# EAGLE design dual_sensor_module (EAGLE 9.4.2)
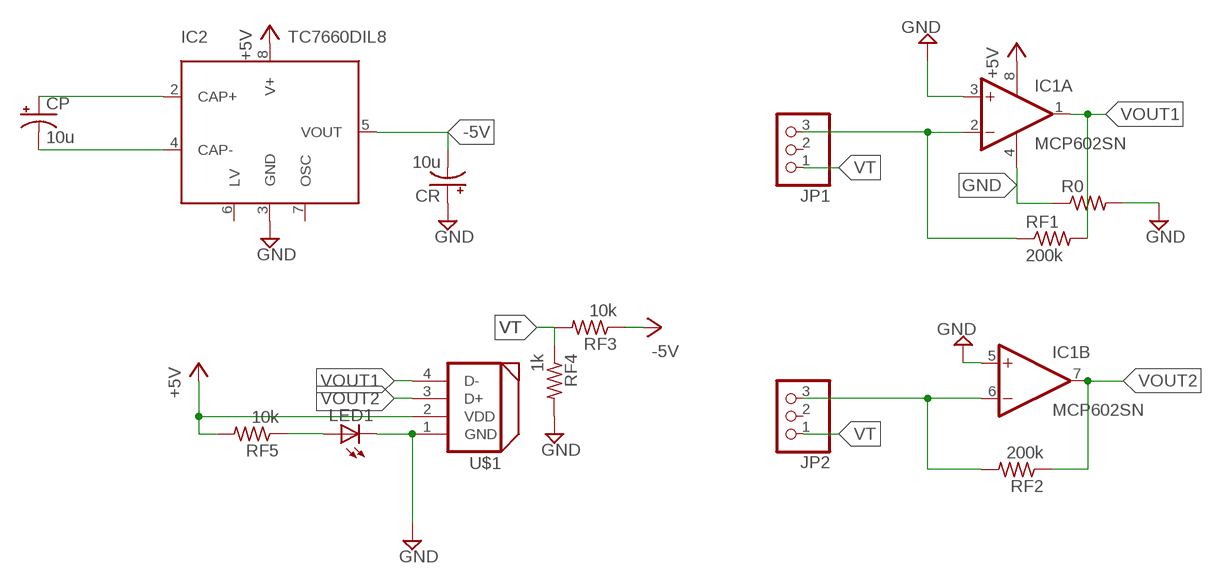
[diagram p0: schematic, sheet 1]

## Parts
CP  10u  CPOL-USE2.5-5  [E2,5-5]
CR  10u  CPOL-USE2.5-5  [E2,5-5]
IC1  MCP602SN  [SO08]
IC2  TC7660DIL8  [DIL8]
JP1  PINHD-1X3  [1X03]
JP2  PINHD-1X3  [1X03]
LED1  LEDCHIPLED_0805  [CHIPLED_0805]
R0  R-US_R1206  [R1206]
RF1  200k  R-US_R0805  [R0805]
RF2  200k  R-US_R0805  [R0805]
RF3  10k  R-US_R0805  [R0805]
RF4  1k  R-US_R0805  [R0805]
RF5  10k  R-US_R0805  [R0805]
U$1  DYNAMIXEL_RS485  [DYNAMIXEL_SPOX_04]

## Nets
+5V: IC1.8(P:V+) IC2.8(V+) RF5.2 U$1.2(VDD)
-5V: CR.- IC2.5(VOUT) RF3.1
GND: CR.+ IC1.3(A:+IN) IC1.4(P:V-) IC1.5(B:+IN) IC2.3(GND) LED1.C R0.1 R0.2 RF4.2 U$1.1(GND)
N$1: CP.+ IC2.2(CAP+)
N$2: CP.- IC2.4(CAP-)
N$3: LED1.A RF5.1
N$52: IC1.2(A:-IN) JP1.3 RF1.1
N$82: IC1.6(B:-IN) JP2.3 RF2.2
VOUT1: IC1.1(A:OUT) RF1.2 U$1.4(D-)
VOUT2: IC1.7(B:OUT) RF2.1 U$1.3(D+)
VT: JP1.1 JP2.1 RF3.2 RF4.1
Unconnected: IC2.6(LV) IC2.7(OSC) JP1.2 JP2.2

## Library data of the parts
CP CR = rcl:CPOL-US: POLARIZED CAPACITOR, American symbol; SPICEPREFIX: C
IC1 = dedo:MCP602: Single Op Amp 2.7V to 6.0V Single Supply CMOS Source: http://ww1.microchip.com/downloads/en/DeviceDoc/21314g.pdf
IC2 = microchip_tc7660:TC7660: TC7660 Charge Pump DC-to-DC Voltage Converter
JP1 JP2 = adafruit:PINHD-1X3: PIN HEADER
LED1 = adafruit:LED: LED OSRAM: - CHIPLED LG R971, LG N971, LY N971, LG Q971, LY Q971, LO R971, LY R971 LH N974, LH R974 LS Q976, LO Q976, LY Q976 LO Q996 - Hyper CHIPLED LW Q18S LB Q993, LB Q99A, LB R99A - SideLED LS A670, LO A670, LY A670, LG A670, LP A670 LB A673, LV A673, LT A673, LW A673 LH A674 LY A675 LS A676, LA A676, LO A676, LY A676, LW A676 LS A679, LY A679, LG A679 - Hyper Micro SIDELED® LS Y876, LA Y876, LO Y876, LY Y876 LT Y87S - SmartLED LW L88C, LW L88S LB L89C, LB L89S, LG L890 LS L89K, LO L89K, LY L89K LS L896, LA L896, LO L896, LY L896 - TOPLED LS T670, LO T670, LY T670, LG T670, LP T670 LSG T670, LSP T670, LSY T670, LOP T670, LYG T670 LG T671, LOG T671, LSG T671 LB T673, LV T673, LT T673, LW T673 LH T674 LS T676, LA T676, LO T676, LY T676, LB T676, LH T676, LSB T676, LW T676 LB T67C, LV T67C, LT T67C, LS T67K, LO T67K, LY T67K, LW E67C LS E67B, LA E67B, LO E67B, LY E67B, LB E67C, LV E67C, LT E67C LW T67C LS T679, LY T679, LG T679 LS T770, LO T770, LY T770, LG T770, LP T770 LB T773, LV T773, LT T773, LW T773 LH T774 LS E675, LA E675, LY E675, LS T675 LS T776, LA T776, LO T776, LY T776, LB T776 LHGB T686 LT T68C, LB T68C - Hyper Mini TOPLED® LB M676 - Mini TOPLED Santana® LG M470 LS M47K, LO M47K, LY M47K Source: http://www.osram.convergy.de/
R0 = rcl:R-US_: RESISTOR, American symbol; SPICEPREFIX: R
RF1-RF5 = resistor:R-US_: RESISTOR, American symbol
U$1 = robot-hand:DYNAMIXEL_RS485: Dynamixel RS-485 Connector Molex LLC SPOX 4 Male connector Digikey code: WM18888-ND

## Net classes
0 default: clearance 0.205 mm

## Board
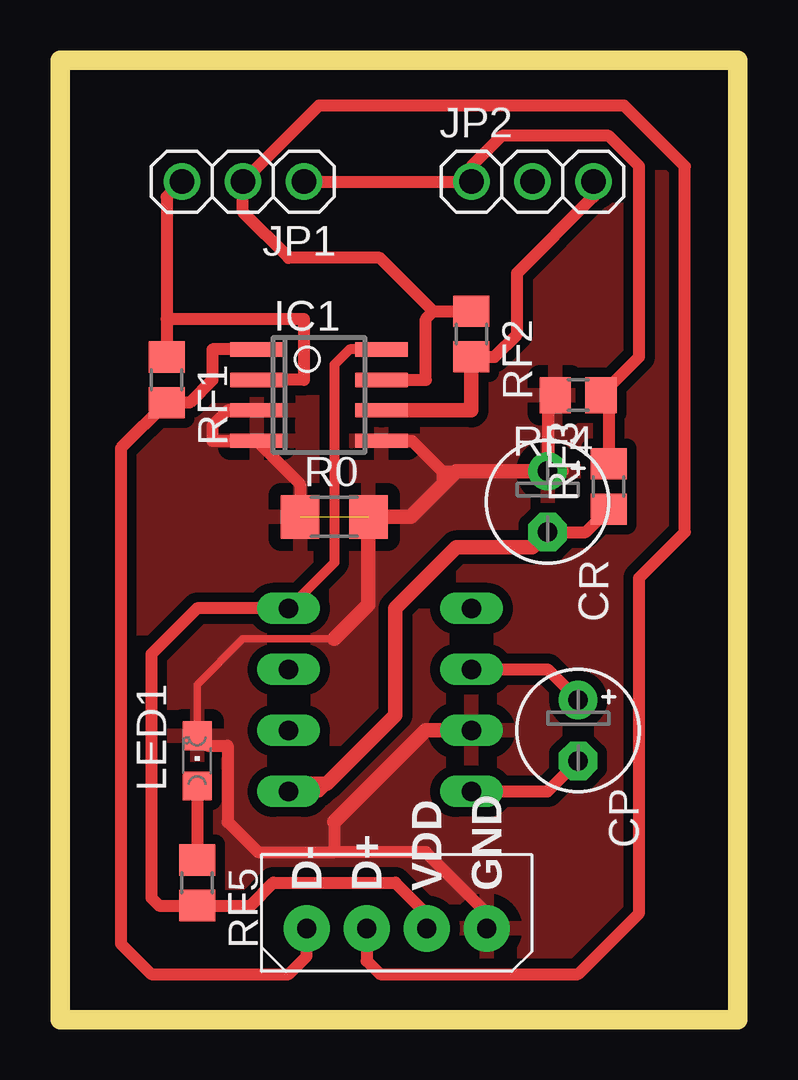
[diagram p1: board, top side]
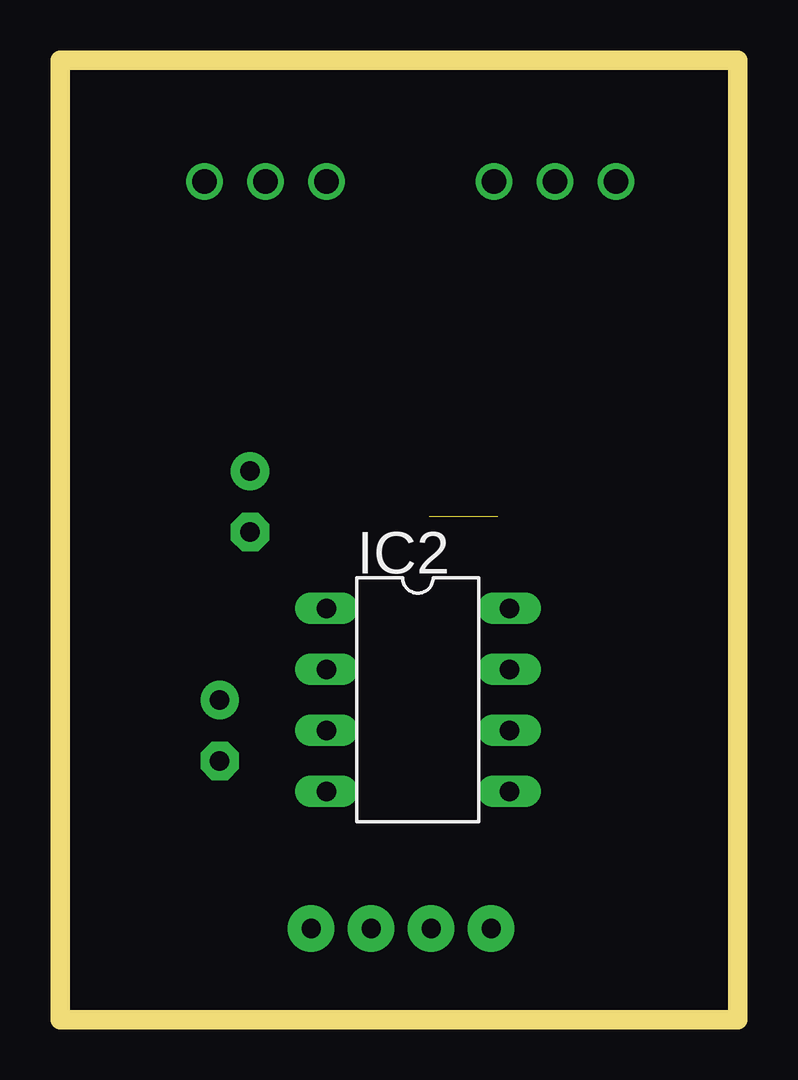
[diagram p2: board, bottom side, seen from below]

Size 28.25 x 39.99 mm. Coordinates in mm from the lower left corner, seen from the top.
Outline: 0,0 28.25,0 28.25,39.99 0,39.99 0,0
Copper layers (1*16): Top 0.035mm / dielectric 1.5mm / Bottom 0.035mm
Design rules "Fablab U. de Chile": minimum track width 0.3mm, minimum drill 0.6mm, track to track 0.3mm, track to pad 0.3mm, pad to pad 0.3mm, via to via 0.3mm, smd to smd 0.3mm, copper to edge 1mm, drill to drill 0.3mm, minimum pad ring 10mil, minimum via ring 10mil, stop-mask expansion 10mil, vias tented up to drill 0mil, thermal gap 20mil

### Footprints (pad centres in the part's own frame; a part is rotated, then mirrored left to right if it is on the bottom)
E2,5-5 = drill 0.813 pad 1.6: + -1.27,0 | drill 0.813 pad 1.6 octagon: - 1.27,0
SO08 = smd 0.6 x 2.2: 1 -1.905,-2.6; 2 -0.635,-2.6; 3 0.635,-2.6; 4 1.905,-2.6; 5 1.905,2.6; 6 0.635,2.6; 7 -0.635,2.6; 8 -1.905,2.6
DIL8 = drill 0.813 long: 1 -3.81,-3.81; 2 -1.27,-3.81; 3 1.27,-3.81; 4 3.81,-3.81; 5 3.81,3.81; 6 1.27,3.81; 7 -1.27,3.81; 8 -3.81,3.81
1X03 = drill 1.016: 1 -2.54,0; 2 0,0; 3 2.54,0
CHIPLED_0805 = smd 1.2 x 1.2: A 0,-1.05; C 0,1.05
R1206 = smd 1.6 x 1.803: 1 -1.422,0; 2 1.422,0
R0805 = smd 1.3 x 1.5: 1 -0.95,0; 2 0.95,0
DYNAMIXEL_SPOX_04 = drill 0.8 pad 1.93: 1 0,0; 2 2.5,0; 3 5,0; 4 7.5,0

### Placement (x,y rotation side)
CP  21.59,12.06 270 top
CR  20.32,21.59 270 top
IC1  10.79,26.04 270 top
IC2  13.33,13.33 270 bottom
JP1  7.62,34.92 180 top
JP2  19.69,34.92 0 top
LED1  5.71,10.79 0 top
R0  11.43,20.96 0 top
RF1  4.45,26.67 270 top
RF2  17.15,28.58 270 top
RF3  22.86,22.23 90 top
RF4  21.59,26.04 180 top
RF5  5.71,5.71 270 top
U$1  17.78,3.81 180 top

### Tracks (layer width: path | path; a pad name or v marks a point on that pad's centre or on a via)
+5V
  Top 0.408: IC1.8 12.06,27.94 11.43,27.31 11.43,19.05 IC2.8
  Top 0.508: IC2.8 5.71,17.15 3.81,15.24 3.81,5.08 4.12,4.76 RF5.2 7.94,4.76 8.89,5.71 13.97,5.71 15.28,4.41 U$1.2
-5V
  Top 0.508: IC2.5 10.16,9.53 10.79,9.53 11.11,9.84 | 22.54,20.96 RF3.1 21.91,20.32 CR.-
  Top 0.61: CR.- 19.69,19.69 16.51,19.69 13.97,17.15 13.97,12.7 11.11,9.84 10.48,9.84 10.16,9.53
GND  (1 unrouted)
  Top 0.305: LED1.C 5.71,13.97 7.62,15.88 11.43,15.88 | 13.97,20.96 13.33,20.96 R0.2
  Top 0.508: LED1.C 6.13,11.43 6.98,11.43 6.98,8.26 8.26,6.98 11.43,6.98 | 11.43,6.98 15.24,6.98 17.78,4.45 U$1.1 | 14.61,11.43 11.43,8.26 11.43,6.98 | 15.94,22.86 15.94,22.29 15.88,22.23 | R0.1 10.01,22.32 IC1.4 6.35,24.13 6.35,24.77 6.98,25.4 IC1.3 | 20.96,22.86 CR.+ 20.32,25.41 20.35,25.44 | 15.94,22.86 16.51,22.86 | RF4.2 20.35,26.33 20.35,25.44 | 20.35,25.44 20.35,23.18 | IC1.5 14.66,24.13 15.94,22.86
  Top 0.61: IC2.3 15.24,12.06 11.43,8.26 | CR.+ 16.51,22.86 15.88,22.23 14.61,20.96 13.33,20.96 | R0.2 12.85,17.3 12.7,17.15 11.43,15.88
  pour Top (isolate 0.406): 0,40 28.58,40 28.58,0 0,0
N$1
  Top 0.508: IC2.2 20.32,14.61 CP.+
N$2
  Top 0.508: IC2.4 20.32,9.53 CP.-
N$3
  Top 0.508: LED1.A RF5.1
N$52
  Top 0.508: JP1.3 4.45,34.29 4.45,29.21 | 4.45,29.21 RF1.1 | 4.45,29.21 10.16,29.21 10.16,26.67 IC1.2
N$82
  Top 0.508: RF2.2 18.1,27.62 19.05,28.58 19.05,31.12 22.23,34.29 JP2.3
  Top 0.61: IC1.6 17.15,25.4 RF2.2
VOUT1
  Top 0.508: IC1.1 6.35,27.94 6.35,26.67 5.4,25.72 RF1.2 2.54,23.82 2.54,3.17 3.81,1.91 9.53,1.91 10.28,2.66 U$1.4
VOUT2
  Top 0.508: IC1.7 15.24,26.67 15.24,29.21 15.55,29.53 | 15.55,29.53 RF2.1 | 15.55,29.53 13.33,31.75 9.53,31.75 7.62,33.66 7.62,34.92 10.79,38.1 23.5,38.1 26.04,35.56 26.04,20.32 24.13,18.42 24.13,4.45 21.59,1.91 13.33,1.91 12.78,2.46 U$1.3
VT
  Top 0.508: RF3.2 22.86,26.04 22.75,26.14 RF4.1 24.13,27.62 24.13,35.56 22.86,36.83 18.42,36.83 17.15,35.56 JP2.1 JP1.1